# EAGLE design PlacaSchematic_075 (EAGLE 5.11)
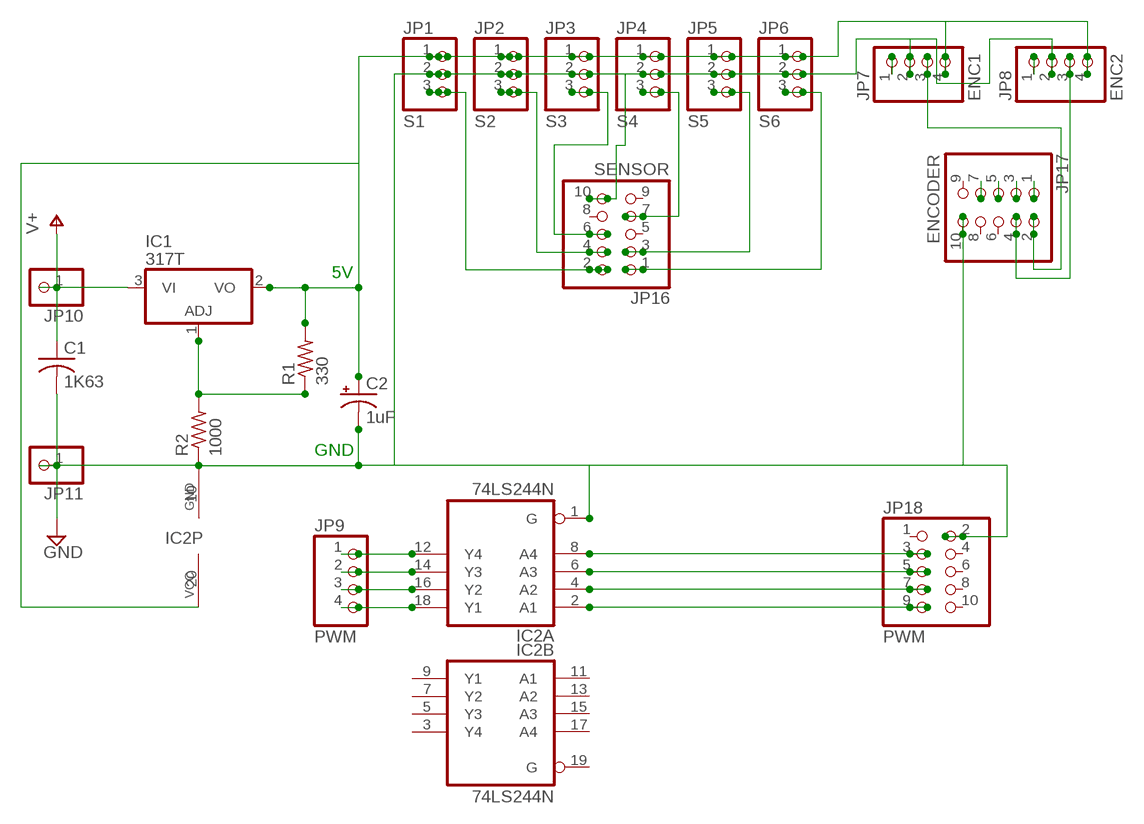
[diagram p0: schematic, sheet 1]

## Parts
C1  1K63  C-US050-025X075  [C050-025X075]
C2  1uF  CPOL-USE2-5  [E2-5]
IC1  317T  [TO220H]
IC2  74LS244N  [DIL20]
JP1  S1  PINHD-1X3  [1X03]
JP2  S2  PINHD-1X3  [1X03]
JP3  S3  PINHD-1X3  [1X03]
JP4  S4  PINHD-1X3  [1X03]
JP5  S5  PINHD-1X3  [1X03]
JP6  S6  PINHD-1X3  [1X03]
JP7  ENC1  PINHD-1X4  [1X04]
JP8  ENC2  PINHD-1X4  [1X04]
JP9  PWM  PINHD-1X4  [1X04]
JP10  PINHD-1X1  [1X01]
JP11  PINHD-1X1  [1X01]
JP16  SENSOR  PINHD-2X5  [2X05]
JP17  ENCODER  PINHD-2X5  [2X05]
JP18  PWM  PINHD-2X5  [2X05]
R1  330  R-US_0207/10  [0207/10]
R2  1000  R-US_0207/10  [0207/10]

## Nets
GND: C1.2 C2.- IC2.1(A:G) IC2.10(P:GND) JP1.2 JP2.2 JP3.2 JP4.2 JP5.2 JP6.2 JP7.2 JP8.2 JP11.1 JP16.10 JP17.10 JP18.2 R2.1
N$1: IC1.1(ADJ) R1.1 R2.2
N$2: C2.+ IC1.2(VO) IC2.20(P:VCC) JP1.1 JP2.1 JP3.1 JP4.1 JP5.1 JP6.1 JP7.4 JP8.4 R1.2
N$3: JP8.3 JP17.4
N$4: IC2.12(A:Y4) JP9.1
N$5: IC2.14(A:Y3) JP9.2
N$6: IC2.16(A:Y2) JP9.3
N$7: IC2.18(A:Y1) JP9.4
N$8: IC2.8(A:A4) JP18.3
N$9: IC2.6(A:A3) JP18.5
N$10: IC2.4(A:A2) JP18.7
N$11: IC2.2(A:A1) JP18.9
N$12: JP8.1
N$13: JP7.3 JP17.2
N$14: JP17.7
N$15: JP1.3 JP16.2
N$16: JP2.3 JP16.4
N$17: JP3.3 JP16.6
N$18: JP4.3 JP16.7
N$19: JP5.3 JP16.3
N$20: JP6.3 JP16.1
N$21: JP7.1
N$22: JP17.5
N$23: JP17.3
N$24: JP17.1
V+: C1.1 IC1.3(VI) JP10.1
Unconnected: IC2.3(B:Y4) IC2.5(B:Y3) IC2.7(B:Y2) IC2.9(B:Y1) IC2.11(B:A1) IC2.13(B:A2) IC2.15(B:A3) IC2.17(B:A4) IC2.19(B:G) JP16.5 JP16.8 JP16.9 JP17.6 JP17.8 JP17.9 JP18.1 JP18.4 JP18.6 JP18.8 JP18.10

## Notes on the sheet
- 5V
- GND

## Library data of the parts
C1 = rcl:C-US: CAPACITOR, American symbol
C2 = rcl:CPOL-US: POLARIZED CAPACITOR, American symbol
IC1 = linear:*317: Positive VOLTAGE REGULATOR
IC2 = 74xx-us:74*244: Octal BUFFER and LINE DRIVER, 3-state
JP1-JP6 = pinhead:PINHD-1X3: PIN HEADER
JP7-JP9 = pinhead:PINHD-1X4: PIN HEADER
JP10 JP11 = pinhead:PINHD-1X1: PIN HEADER
JP16-JP18 = pinhead:PINHD-2X5: PIN HEADER
R1 R2 = resistor:R-US_: RESISTOR, American symbol

## Board
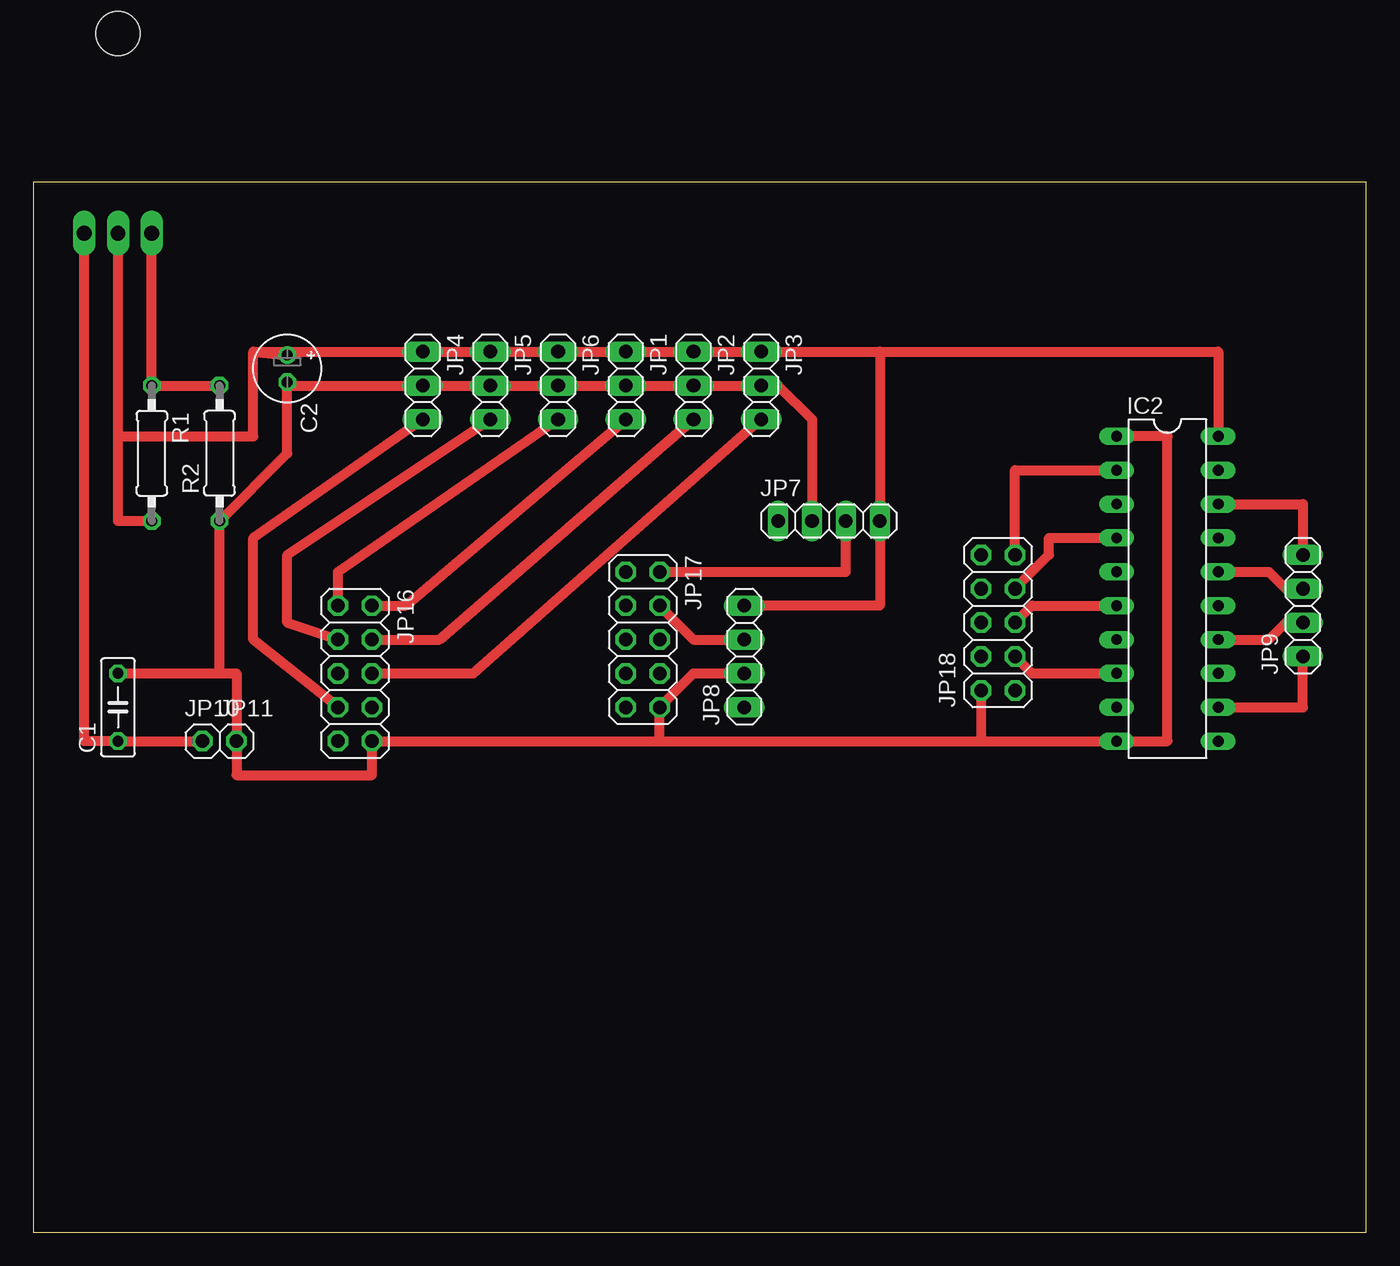
[diagram p1: board, top side]
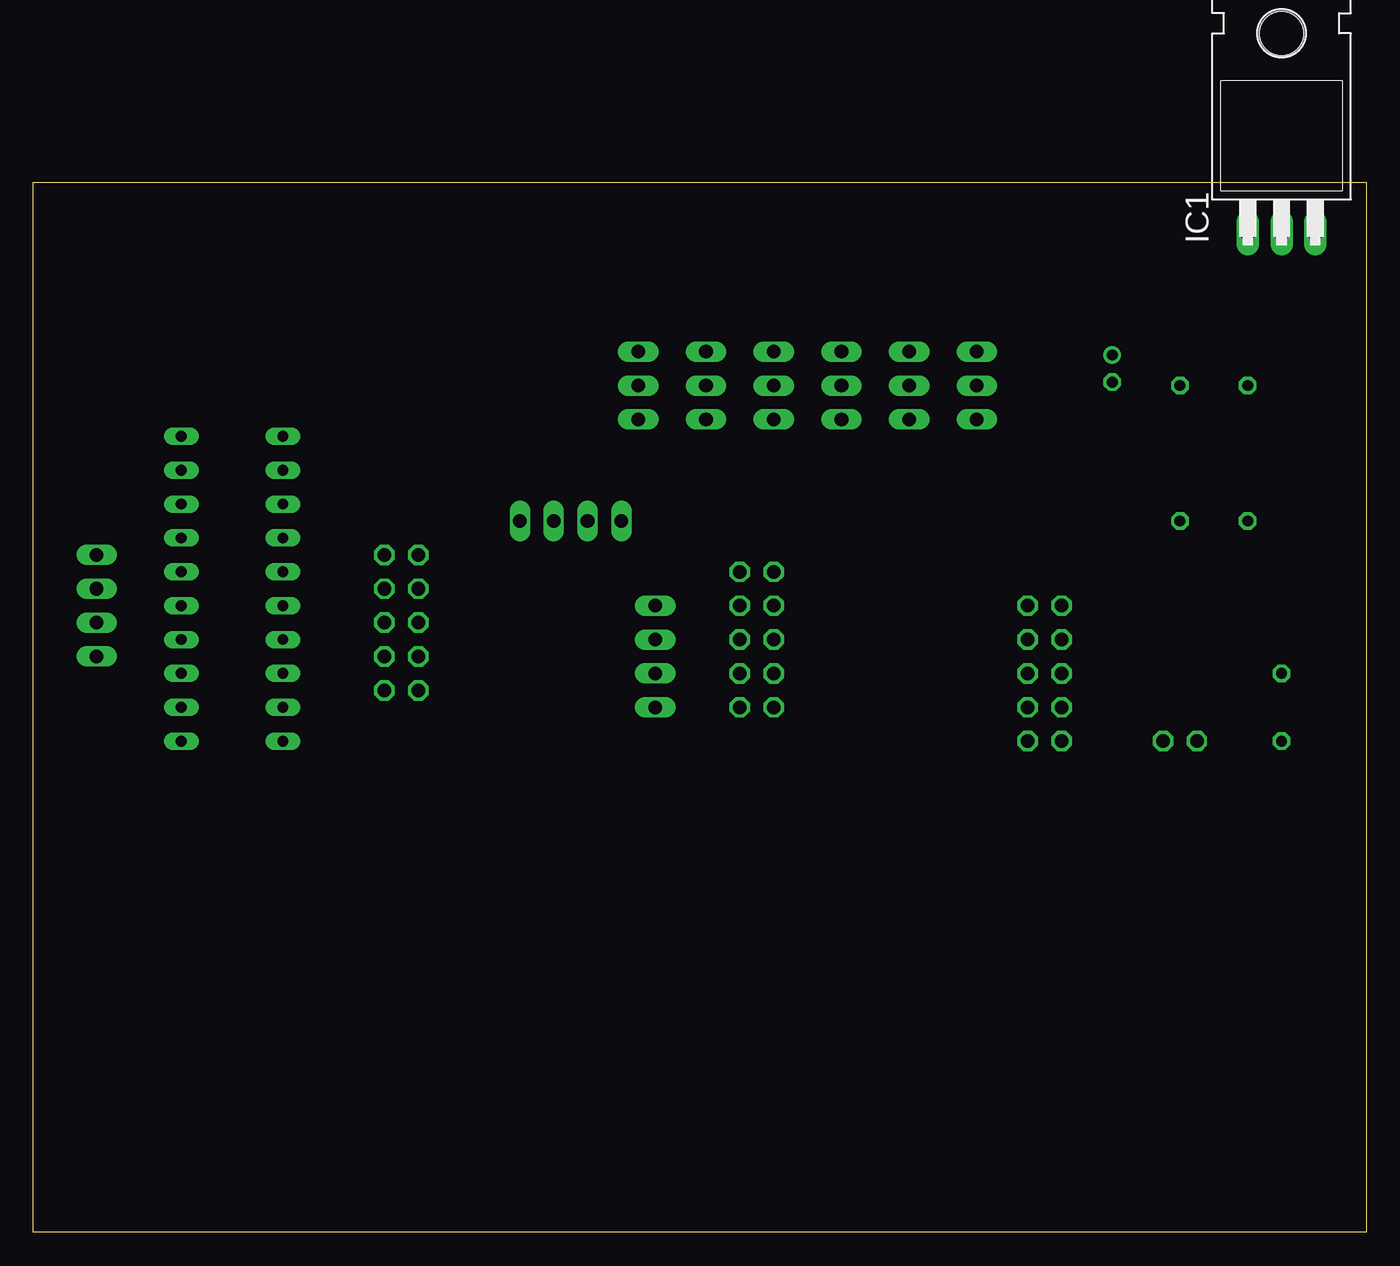
[diagram p2: board, bottom side, seen from below]

Size 100 x 78.73 mm. Coordinates in mm from the lower left corner, seen from the top.
Outline: 0,0 100,0 100,78.73 0,78.73 0,0
Copper layers (1*16): Top 0.035mm / dielectric 1.5mm / Bottom 0.035mm
Design rules "default *": minimum track width 30mil, minimum drill 24mil, track to track 8mil, track to pad 8mil, pad to pad 8mil, via to via 8mil, smd to smd 8mil, copper to edge 40mil, drill to drill 8mil, minimum pad ring 10mil, minimum via ring 8mil, stop-mask expansion 4mil, vias tented up to drill 0mil, thermal gap 10mil

### Footprints (pad centres in the part's own frame; a part is rotated, then mirrored left to right if it is on the bottom)
C050-025X075 = drill 0.813 octagon: 1 -2.54,0; 2 2.54,0
E2-5 = drill 0.813 pad 1.27 round: + -1.016,0 | drill 0.813 pad 1.27 octagon: - 1.016,0
TO220H = drill 1.118 long: 1 -2.54,-10.16; 2 0,-10.16; 3 2.54,-10.16 | hole 3.302: 0,4.826
DIL20 = drill 0.813 long: 1 -11.43,-3.81; 2 -8.89,-3.81; 3 -6.35,-3.81; 4 -3.81,-3.81; 5 -1.27,-3.81; 6 1.27,-3.81; 7 3.81,-3.81; 8 6.35,-3.81; 9 8.89,-3.81; 10 11.43,-3.81; 11 11.43,3.81; 12 8.89,3.81; 13 6.35,3.81; 14 3.81,3.81; 15 1.27,3.81; 16 -1.27,3.81; 17 -3.81,3.81; 18 -6.35,3.81; 19 -8.89,3.81; 20 -11.43,3.81
1X03 = drill 1.016 long: 1 -2.54,0; 2 0,0; 3 2.54,0
1X04 = drill 1.016 long: 1 -3.81,0; 2 -1.27,0; 3 1.27,0; 4 3.81,0
1X01 = drill 1.016 octagon: 1 0,0
2X05 = drill 1.016 octagon: 1 -5.08,-1.27; 2 -5.08,1.27; 3 -2.54,-1.27; 4 -2.54,1.27; 5 0,-1.27; 6 0,1.27; 7 2.54,-1.27; 8 2.54,1.27; 9 5.08,-1.27; 10 5.08,1.27
0207/10 = drill 0.813 octagon: 1 -5.08,0; 2 5.08,0

### Placement (x,y rotation side)
C1  6.35,39.37 90 top
C2  19.05,64.77 270 top
IC1  6.35,85.09 0 bottom
IC2  85.09,48.26 270 top
JP1  44.45,63.5 270 top
JP2  49.53,63.5 270 top
JP3  54.61,63.5 270 top
JP4  29.21,63.5 270 top
JP5  34.29,63.5 270 top
JP6  39.37,63.5 270 top
JP7  59.69,53.34 0 top
JP8  53.34,43.18 90 top
JP9  95.25,46.99 90 top
JP10  12.7,36.83 0 top
JP11  15.24,36.83 0 top
JP16  24.13,41.91 270 top
JP17  45.72,44.45 270 top
JP18  72.39,45.72 90 top
R1  8.89,58.42 270 top
R2  13.97,58.42 90 top

### Tracks (layer width: path | path; a pad name or v marks a point on that pad's centre or on a via)
GND
  Top 0.762: 71.12,36.83 IC2.10 85.09,36.83 85.09,59.69 IC2.1 | 71.12,36.83 JP18.2 | 46.99,36.83 JP16.10 25.4,34.29 15.24,34.29 JP11.1 15.24,41.91 13.97,41.91 | 46.99,36.83 JP17.10 49.53,41.91 JP8.2 | C1.2 13.97,41.91 | 13.97,41.91 R2.1 19.05,58.42 19.05,63.5 | 19.05,63.5 JP4.2 JP5.2 JP6.2 JP1.2 JP2.2 JP3.2 55.88,63.5 58.42,60.96 JP7.2 | 19.05,63.5 C2.- | 46.99,36.83 71.12,36.83
N$1
  Top 0.762: R2.2 R1.1 IC1.1
N$2
  Top 0.762: IC2.20 88.9,66.04 63.5,66.04 | 63.5,66.04 JP7.4 63.5,46.99 JP8.4 | R1.2 6.35,53.34 6.35,59.69 | 6.35,59.69 IC1.2 | 16.51,66.04 JP4.1 JP5.1 JP6.1 JP1.1 JP2.1 JP3.1 63.5,66.04 | 6.35,59.69 16.51,59.69 16.51,66.04 | 16.51,66.04 C2.+
N$3
  Top 0.762: JP8.3 49.53,44.45 JP17.4
N$4
  Top 0.762: IC2.12 95.25,39.37 JP9.1
N$5
  Top 0.762: IC2.14 92.71,44.45 93.98,45.72 JP9.2
N$6
  Top 0.762: IC2.16 92.71,49.53 93.98,48.26 JP9.3
N$7
  Top 0.762: IC2.18 95.25,54.61 JP9.4
N$8
  Top 0.762: IC2.8 74.93,41.91 JP18.3
N$9
  Top 0.762: IC2.6 74.93,46.99 JP18.5
N$10
  Top 0.762: IC2.4 76.2,52.07 76.2,50.8 JP18.7
N$11
  Top 0.762: IC2.2 73.66,57.15 JP18.9
N$13
  Top 0.762: JP17.2 60.96,49.53 JP7.3
N$15
  Top 0.762: JP16.2 27.94,46.99 JP1.3
N$16
  Top 0.762: JP16.4 30.48,44.45 JP2.3
N$17
  Top 0.762: JP16.6 33.02,41.91 JP3.3
N$18
  Top 0.762: JP16.7 16.51,44.45 16.51,52.07 JP4.3
N$19
  Top 0.762: JP16.3 19.05,45.72 19.05,50.8 JP5.3
N$20
  Top 0.762: JP16.1 22.86,49.53 JP6.3
V+
  Top 0.762: JP10.1 C1.1 3.81,36.83 IC1.3